# Altium schematic sheet Sheet1.SchDoc
size A4
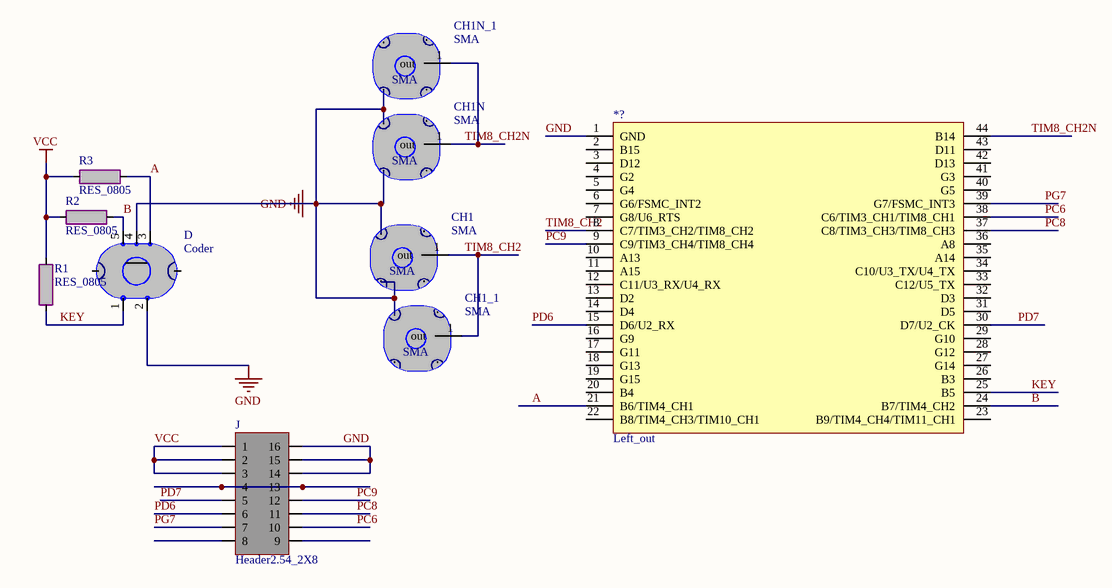
[diagram p0: Sheet1.SchDoc]

## Parts
*?  Left_out  [Header2.54_2X22]
CH1  SMA  [SMA]
CH1_1  SMA  [SMA]
CH1N  SMA  [SMA]
CH1N_1  SMA  [SMA]
D  Coder  [Coder]
J  Header2.54_2X8  [Header 2.54_2X8]
R1  RES_0805  [0805_R]
R2  RES_0805  [0805_R]
R3  RES_0805  [0805_R]

## Nets
GND: *?.1(GND) CH1.0(hole) CH1_1.0(hole) CH1N.0(hole) CH1N_1.0(hole) D.2(GND) D.4(GND) J.14 J.15 J.16
VCC: J.1 J.2 J.3 R1.2 R2.2 R3.1
A: *?.21(B6/TIM4_CH1) D.3(B) R3.2
B: *?.24(B7/TIM4_CH2) D.5(A) R2.1
KEY: *?.25(B5) D.1(key) R1.1
PC6: *?.38(C6/TIM3_CH1/TIM8_CH1) J.10
PC8: *?.37(C8/TIM3_CH3/TIM8_CH3) J.11
PC9: *?.9(C9/TIM3_CH4/TIM8_CH4) J.12
PD6: *?.15(D6/U2_RX) J.6
PD7: *?.30(D7/U2_CK) J.5
PG7: *?.39(G7/FSMC_INT3) J.7
TIM8_CH2: *?.8(C7/TIM3_CH2/TIM8_CH2) CH1.1(out) CH1_1.1(out)
TIM8_CH2N: *?.44(B14) CH1N.1(out) CH1N_1.1(out)
NetJ_4: J.4 J.13

Not connected (* = marked no-connect by the designer): *? 2(B15) 3(D12) 4(G2) 5(G4) 6(G6/FSMC_INT2) 7(G8/U6_RTS) 10(A13) 11(A15) 12(C11/U3_RX/U4_RX) 13(D2) 14(D4) 16(G9) 17(G11) 18(G13) 19(G15) 20(B4) 22(B8/TIM4_CH3/TIM10_CH1) 23(B9/TIM4_CH4/TIM11_CH1) 26(B3) 27(G14) 28(G12) 29(G10) 31(D5) 32(D3) 33(C12/U5_TX) 34(C10/U3_TX/U4_TX) 35(A14) 36(A8) 40(G5) 41(G3) 42(D13) 43(D11); D 0(hole); J 8 9

## Library data of the parts
R1-R3 = RES_0805: 贴片电阻，0805封装